# EAGLE design Summing (EAGLE 6.5.0)
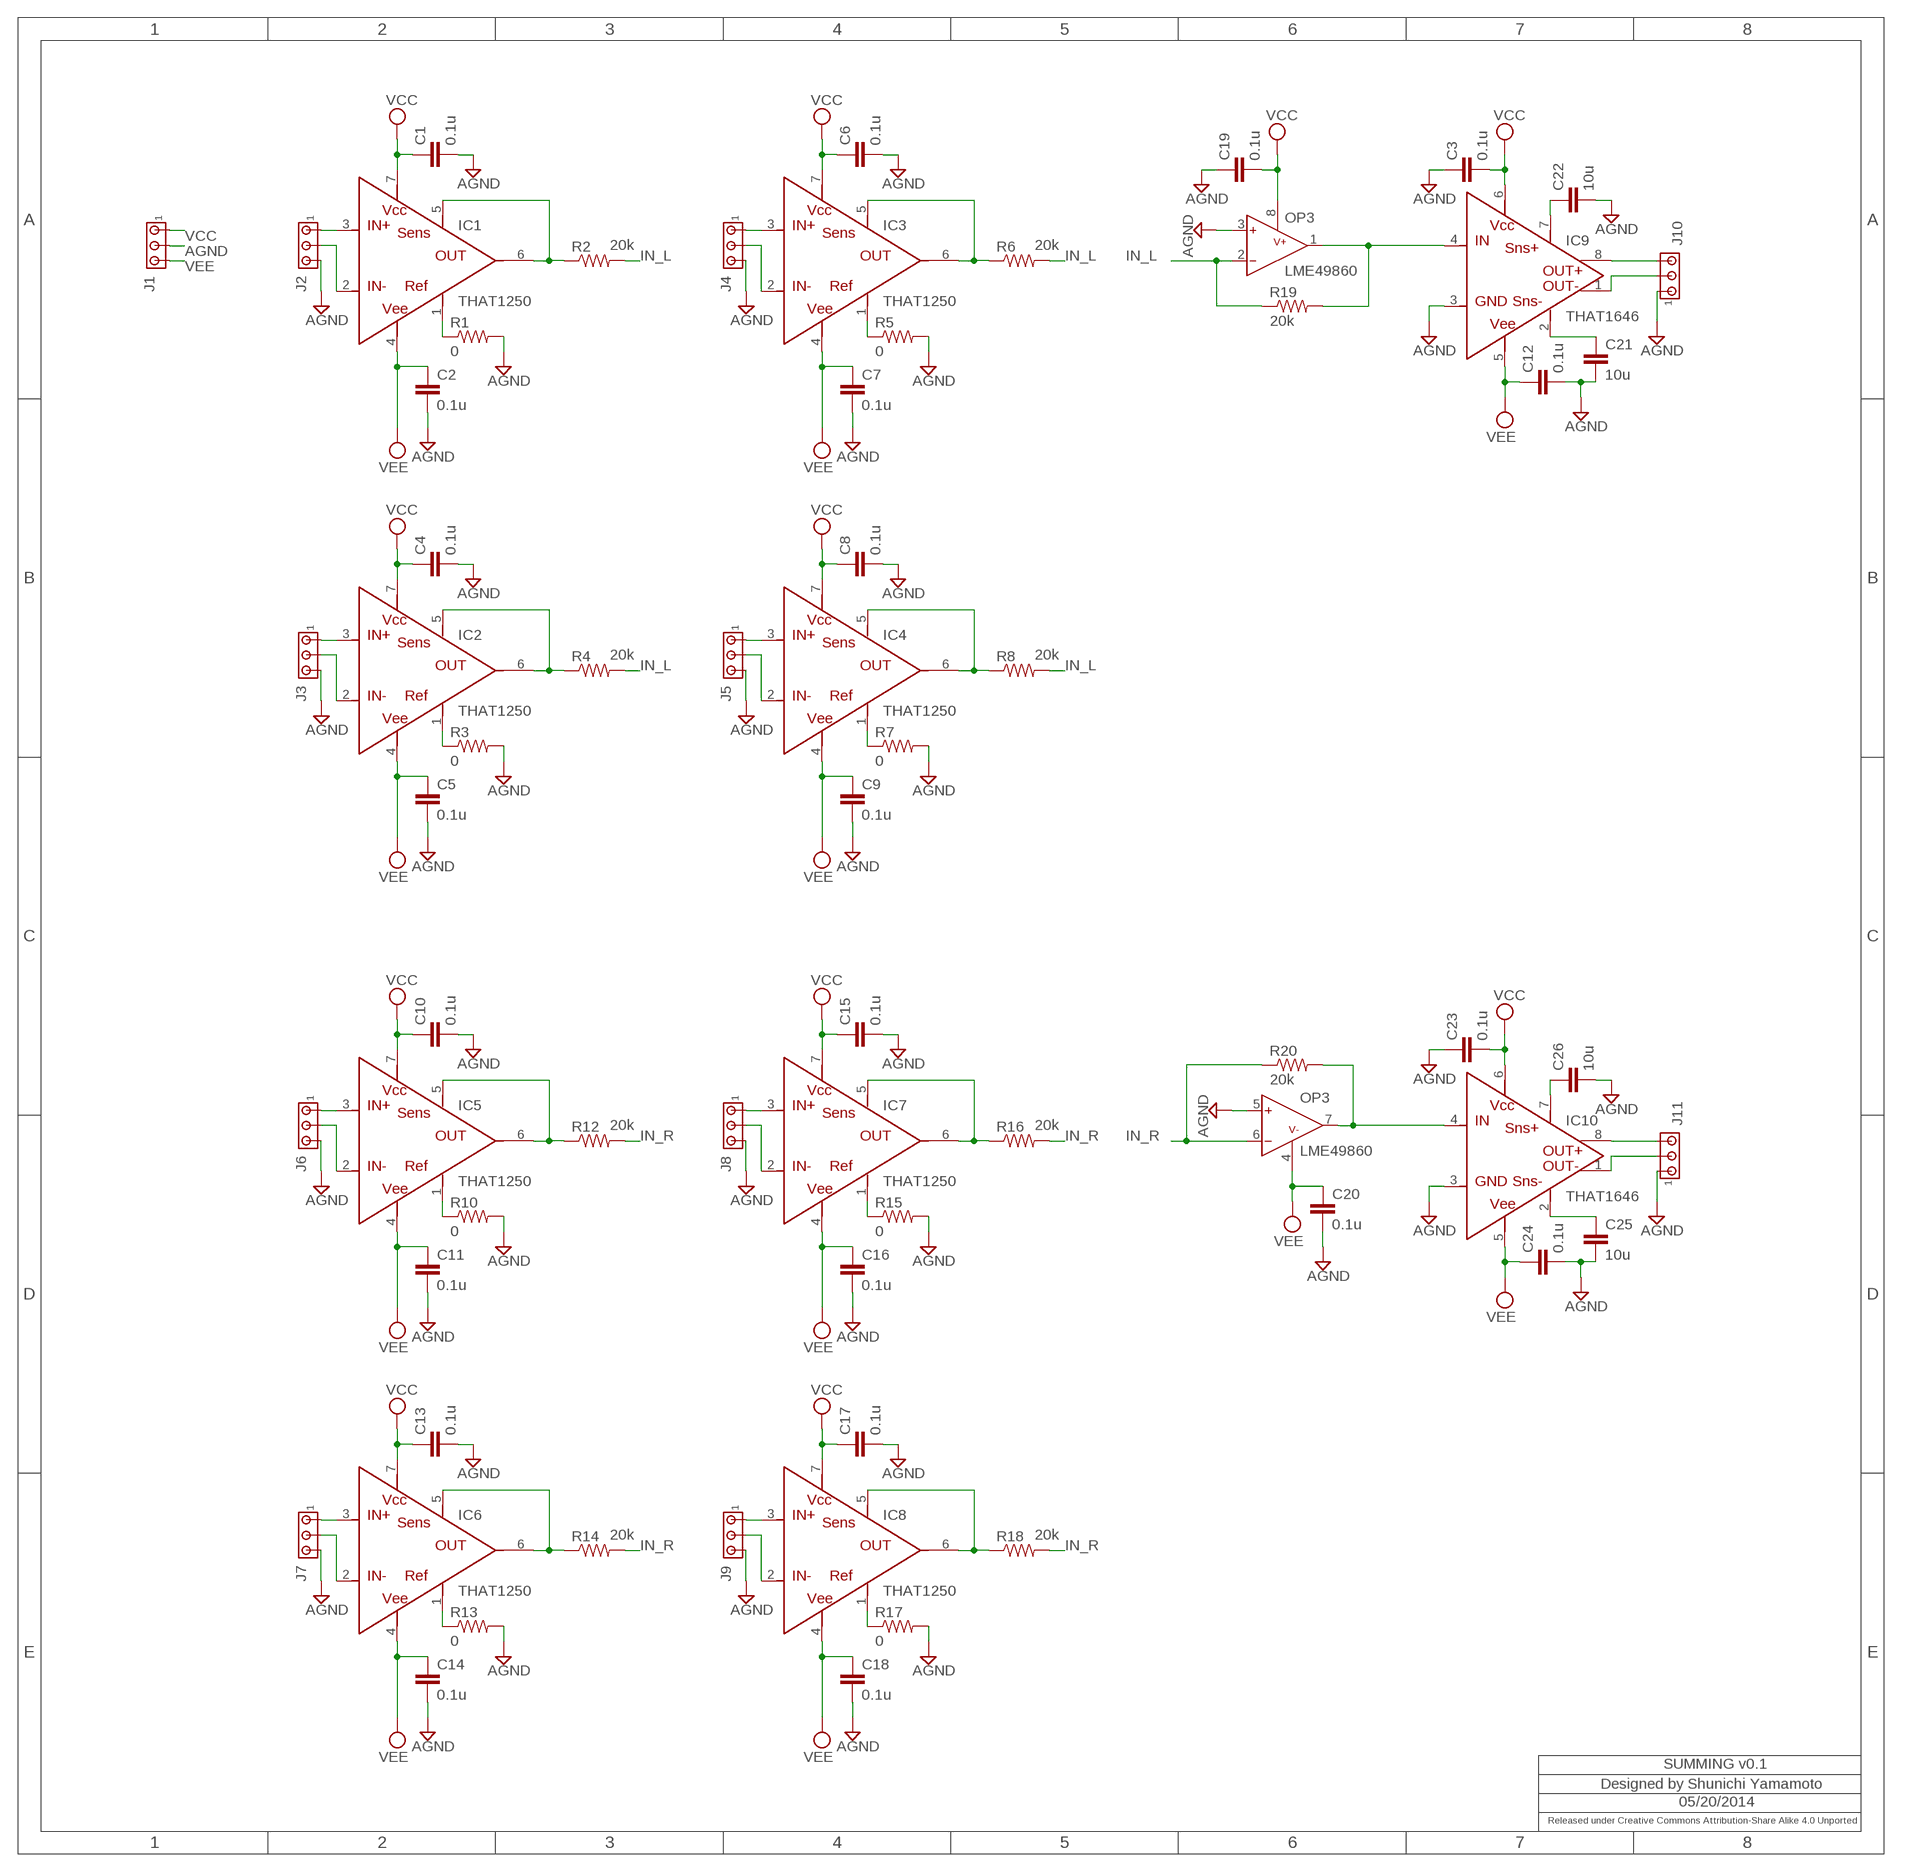
[diagram p0: schematic, sheet 1]

## Parts
C1  0.1u  C-EUC2012  [C2012]
C2  0.1u  C-EUC2012  [C2012]
C3  0.1u  C-EUC2012  [C2012]
C4  0.1u  C-EUC2012  [C2012]
C5  0.1u  C-EUC2012  [C2012]
C6  0.1u  C-EUC2012  [C2012]
C7  0.1u  C-EUC2012  [C2012]
C8  0.1u  C-EUC2012  [C2012]
C9  0.1u  C-EUC2012  [C2012]
C10  0.1u  C-EUC2012  [C2012]
C11  0.1u  C-EUC2012  [C2012]
C12  0.1u  C-EUC2012  [C2012]
C13  0.1u  C-EUC2012  [C2012]
C14  0.1u  C-EUC2012  [C2012]
C15  0.1u  C-EUC2012  [C2012]
C16  0.1u  C-EUC2012  [C2012]
C17  0.1u  C-EUC2012  [C2012]
C18  0.1u  C-EUC2012  [C2012]
C19  0.1u  C-EUC2012  [C2012]
C20  0.1u  C-EUC2012  [C2012]
C21  10u  C-EUC2012  [C2012]
C22  10u  C-EUC2012  [C2012]
C23  0.1u  C-EUC2012  [C2012]
C24  0.1u  C-EUC2012  [C2012]
C25  10u  C-EUC2012  [C2012]
C26  10u  C-EUC2012  [C2012]
IC1  THAT1250  [SOIC8@1]
IC2  THAT1250  [SOIC8@1]
IC3  THAT1250  [SOIC8@1]
IC4  THAT1250  [SOIC8@1]
IC5  THAT1250  [SOIC8@1]
IC6  THAT1250  [SOIC8@1]
IC7  THAT1250  [SOIC8@1]
IC8  THAT1250  [SOIC8@1]
IC9  THAT1646  [SOIC8]
IC10  THAT1646  [SOIC8]
J1  MTA03-156  [1X3MTA]
J2  MTA03-100  [10X03MTA]
J3  MTA03-100  [10X03MTA]
J4  MTA03-100  [10X03MTA]
J5  MTA03-100  [10X03MTA]
J6  MTA03-100  [10X03MTA]
J7  MTA03-100  [10X03MTA]
J8  MTA03-100  [10X03MTA]
J9  MTA03-100  [10X03MTA]
J10  MTA03-100  [10X03MTA]
J11  MTA03-100  [10X03MTA]
OP3  LME49860  [SOIC8@2]
R1  0  RESISTOR0805-RES  [0805]
R2  20k  RESISTOR0805-RES  [0805]
R3  0  RESISTOR0805-RES  [0805]
R4  20k  RESISTOR0805-RES  [0805]
R5  0  RESISTOR0805-RES  [0805]
R6  20k  RESISTOR0805-RES  [0805]
R7  0  RESISTOR0805-RES  [0805]
R8  20k  RESISTOR0805-RES  [0805]
R10  0  RESISTOR0805-RES  [0805]
R12  20k  RESISTOR0805-RES  [0805]
R13  0  RESISTOR0805-RES  [0805]
R14  20k  RESISTOR0805-RES  [0805]
R15  0  RESISTOR0805-RES  [0805]
R16  20k  RESISTOR0805-RES  [0805]
R17  0  RESISTOR0805-RES  [0805]
R18  20k  RESISTOR0805-RES  [0805]
R19  20k  RESISTOR0805-RES  [0805]
R20  20k  RESISTOR0805-RES  [0805]

## Nets
AGND: C1.2 C2.2 C3.1 C4.2 C5.2 C6.2 C7.2 C8.2 C9.2 C10.2 C11.2 C12.2 C13.2 C14.2 C15.2 C16.2 C17.2 C18.2 C19.1 C20.2 C21.2 C22.2 C23.1 C24.2 C25.2 C26.2 IC9.3(GND) IC10.3(GND) J1.2 J2.3 J3.3 J4.3 J5.3 J6.3 J7.3 J8.3 J9.3 J10.1 J11.1 OP3.3(INA+) OP3.5(INB+) R1.2 R3.2 R5.2 R7.2 R10.2 R13.2 R15.2 R17.2
IN_L: OP3.2(INA-) R2.2 R4.2 R6.2 R8.2 R19.1
IN_R: OP3.6(INB-) R12.2 R14.2 R16.2 R18.2 R20.1
MGAIN_L2: IC9.4(IN) OP3.1(OUTA) R19.2
MGAIN_R: IC10.4(IN) OP3.7(OUTB) R20.2
N$1: IC1.1(REF) R1.1
N$2: IC2.1(REF) R3.1
N$3: IC1.3(IN+) J2.1
N$4: IC1.2(IN-) J2.2
N$5: IC2.3(IN+) J3.1
N$6: IC2.2(IN-) J3.2
N$7: IC3.1(REF) R5.1
N$8: IC3.3(IN+) J4.1
N$9: IC3.2(IN-) J4.2
N$10: IC4.1(REF) R7.1
N$11: IC4.3(IN+) J5.1
N$12: IC4.2(IN-) J5.2
N$13: IC5.1(REF) R10.1
N$14: IC5.3(IN+) J6.1
N$15: IC5.2(IN-) J6.2
N$16: IC6.1(REF) R13.1
N$17: IC6.3(IN+) J7.1
N$18: IC6.2(IN-) J7.2
N$19: IC7.1(REF) R15.1
N$20: IC7.3(IN+) J8.1
N$21: IC7.2(IN-) J8.2
N$22: IC8.1(REF) R17.1
N$23: IC8.3(IN+) J9.1
N$24: IC8.2(IN-) J9.2
N$25: C22.1 IC9.7(SNS+)
N$26: IC9.8(OUT+) J10.3
N$27: IC9.1(OUT-) J10.2
N$28: C26.1 IC10.7(SNS+)
N$29: C25.1 IC10.2(SNS-)
N$30: IC10.8(OUT+) J11.3
N$31: IC10.1(OUT-) J11.2
N$34: C21.1 IC9.2(SNS-)
PIN_L: IC1.5(SENS) IC1.6(OUT) R2.1
PIN_L1: IC2.5(SENS) IC2.6(OUT) R4.1
PIN_L2: IC3.5(SENS) IC3.6(OUT) R6.1
PIN_L3: IC4.5(SENS) IC4.6(OUT) R8.1
PIN_L4: IC5.5(SENS) IC5.6(OUT) R12.1
PIN_L5: IC6.5(SENS) IC6.6(OUT) R14.1
PIN_L6: IC7.5(SENS) IC7.6(OUT) R16.1
PIN_L7: IC8.5(SENS) IC8.6(OUT) R18.1
VCC: C1.1 C3.2 C4.1 C6.1 C8.1 C10.1 C13.1 C15.1 C17.1 C19.2 C23.2 IC1.7(VCC) IC2.7(VCC) IC3.7(VCC) IC4.7(VCC) IC5.7(VCC) IC6.7(VCC) IC7.7(VCC) IC8.7(VCC) IC9.6(VCC) IC10.6(VCC) J1.1 OP3.8(V+)
VEE: C2.1 C5.1 C7.1 C9.1 C11.1 C12.1 C14.1 C16.1 C18.1 C20.1 C24.1 IC1.4(VEE) IC2.4(VEE) IC3.4(VEE) IC4.4(VEE) IC5.4(VEE) IC6.4(VEE) IC7.4(VEE) IC8.4(VEE) IC9.5(VEE) IC10.5(VEE) J1.3 OP3.4(V-)

## Notes on the sheet
- SUMMING v0.1
- Designed by Shunichi Yamamoto
- 05/20/2014
- Released under Creative Commons Attribution-Share Alike 4.0 Unported

## Library data of the parts
C1-C26 = rcl:C-EU: CAPACITOR, European symbol
IC1-IC8 = thatcorp:THAT1250
IC9 IC10 = thatcorp:THAT1646
J1 = con-amp:MTA03-156: AMP connector
J2-J11 = con-amp:MTA03-100: AMP connector
OP3 = thatcorp:LME49860
R1-R8 R10 R12-R20 = SparkFun:RESISTOR: Resistor Basic schematic elements and footprints for 0603, 1206, and PTH resistors.

## Board
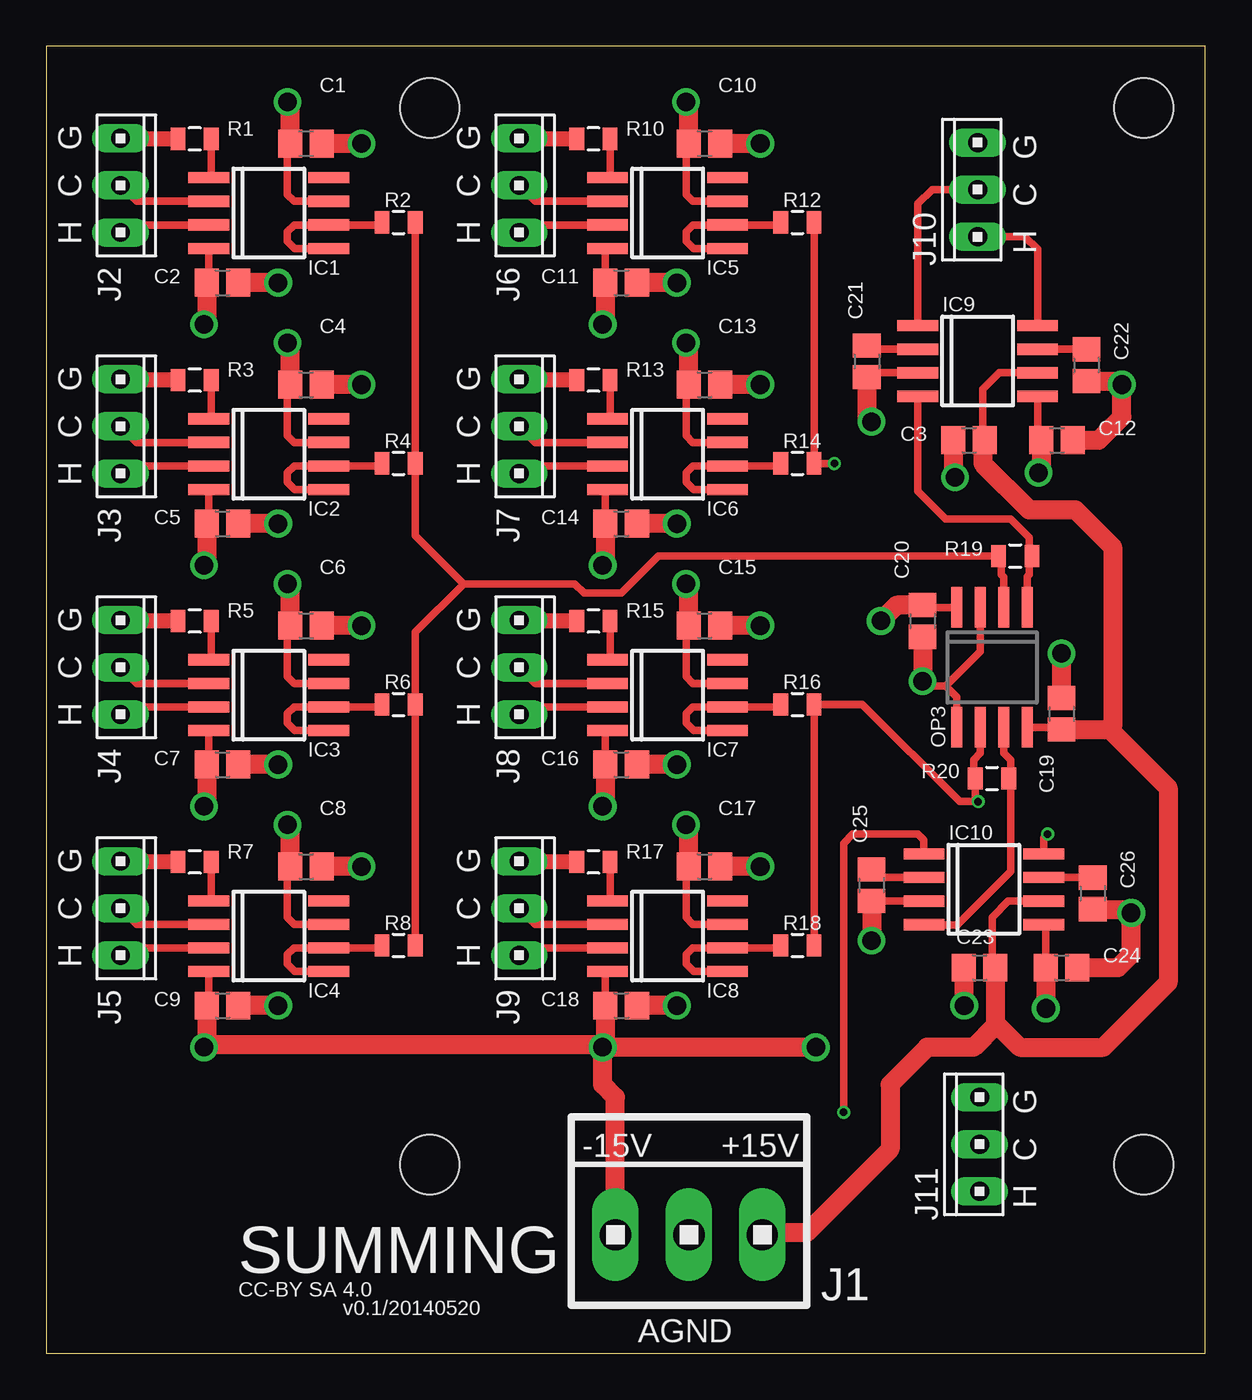
[diagram p1: board, top side]
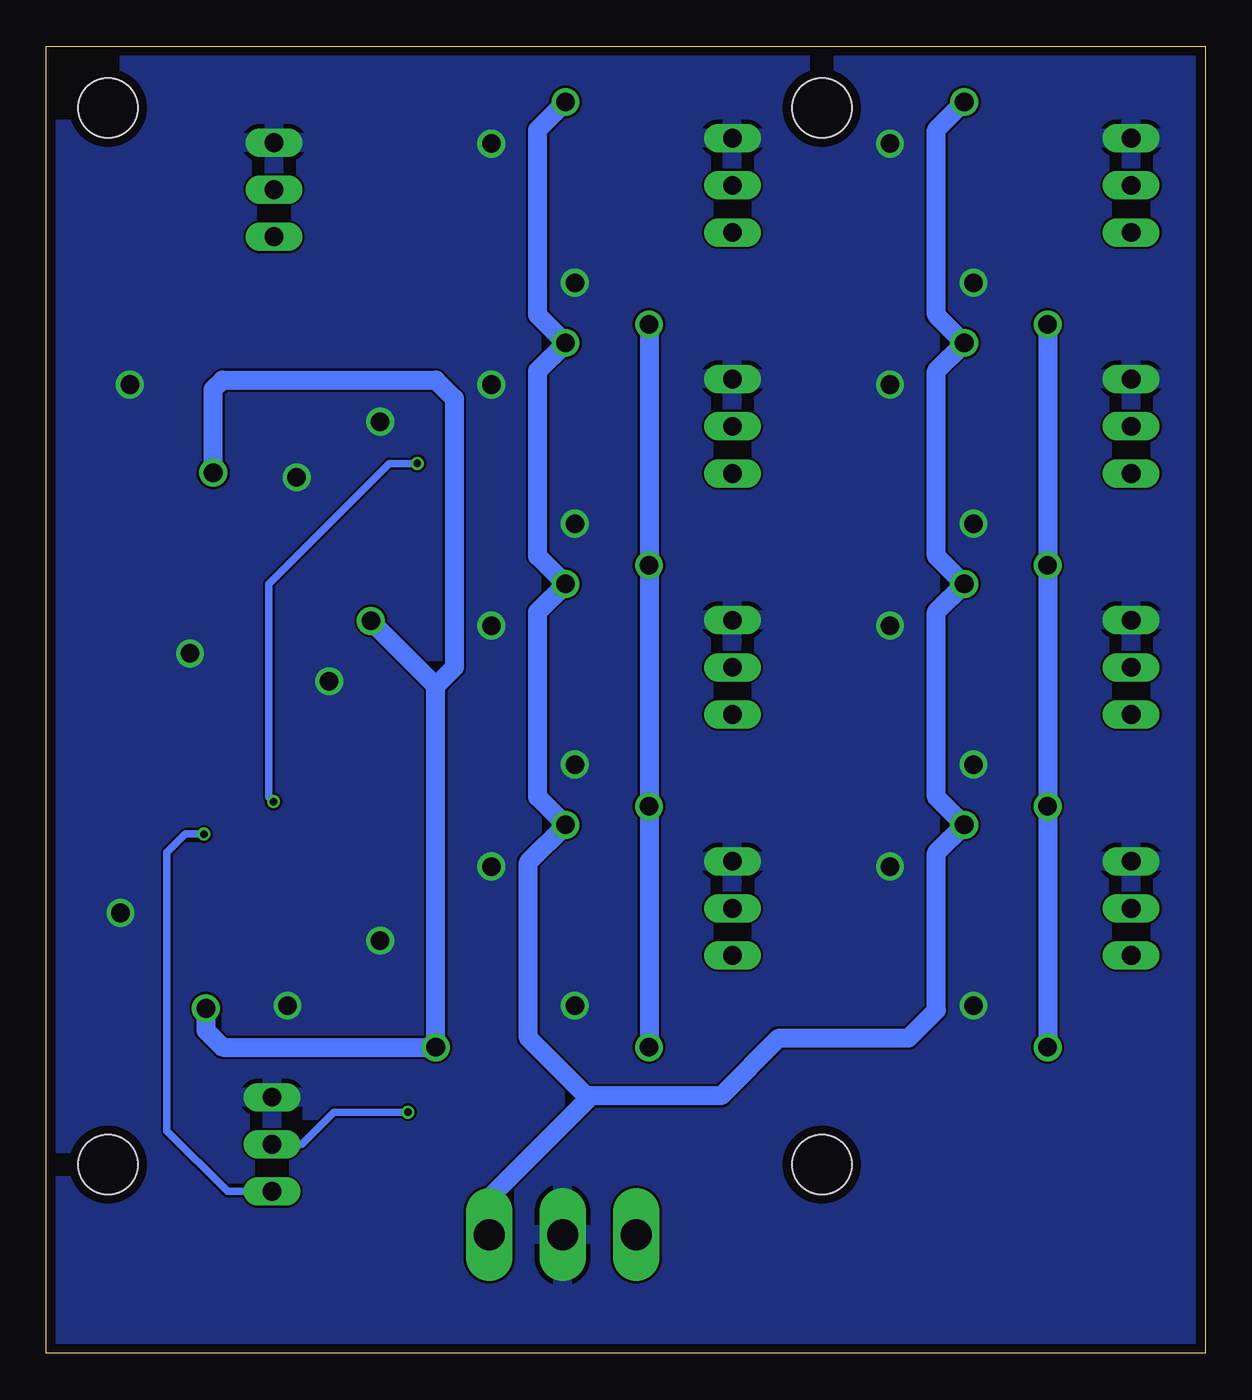
[diagram p2: board, bottom side, seen from below]

Size 62.5 x 70.5 mm. Coordinates in mm from the lower left corner, seen from the top.
Outline: 0,0 62.5,0 62.5,70.5 0,70.5 0,0
Copper layers (1+2*3+16): Top 0.018mm / dielectric 0.25mm / Route2 0.035mm / dielectric 1mm / Route3 0.035mm / dielectric 0.2mm / Bottom 0.018mm
Design rules "pban_5mil-l4-a": minimum track width 5mil, minimum drill 0.3mm, track to track 5mil, track to pad 0.229mm, pad to pad 5mil, via to via 5mil, smd to smd 5mil, copper to edge 0.5mm, drill to drill 0.5mm, minimum pad ring 0.15mm, minimum via ring 0.15mm, stop-mask expansion 4mil, vias tented up to drill 0.35mm, thermal gap 10mil
Holes 3.2 mm at 20.68,10.18 20.68,67.17 59.17,10.18 59.17,67.17

### Footprints (pad centres in the part's own frame; a part is rotated, then mirrored left to right if it is on the bottom)
C2012 = smd 1.3 x 1.5: 1 -0.85,0; 2 0.85,0
SOIC8@1 = smd 0.6 x 2.2: 1 -1.905,-3.235; 2 -0.635,-3.235; 3 0.635,-3.235; 4 1.905,-3.235; 5 1.905,3.235; 6 0.635,3.235; 7 -0.635,3.235; 8 -1.905,3.235
SOIC8 = smd 0.6 x 2.2: 1 -1.905,-3.235; 2 -0.635,-3.235; 3 0.635,-3.235; 4 1.905,-3.235; 5 1.905,3.235; 6 0.635,3.235; 7 -0.635,3.235; 8 -1.905,3.235
1X3MTA = drill 1.676 long: 1 3.937,0; 2 -0.025,0; 3 -3.988,0
10X03MTA = drill 1.016 long: 1 2.54,0; 2 0,0; 3 -2.54,0
SOIC8@2 = smd 0.6 x 2.2: 1 -1.905,-3.235; 2 -0.635,-3.235; 3 0.635,-3.235; 4 1.905,-3.235; 5 1.905,3.235; 6 0.635,3.235; 7 -0.635,3.235; 8 -1.905,3.235
0805 = smd 0.8 x 1.2: 1 -0.9,0; 2 0.9,0

### Placement (x,y rotation side)
C1  14,65.25 0 top
C2  9.5,57.75 0 top
C3  49.75,49.25 0 top
C4  14,52.25 0 top
C5  9.5,44.75 0 top
C6  14,39.25 0 top
C7  9.5,31.75 0 top
C8  14,26.25 0 top
C9  9.5,18.75 0 top
C10  35.5,65.25 0 top
C11  31,57.75 0 top
C12  54.5,49.25 0 top
C13  35.5,52.25 0 top
C14  31,44.75 0 top
C15  35.5,39.25 0 top
C16  31,31.75 0 top
C17  35.5,26.25 0 top
C18  31,18.75 0 top
C19  54.75,34.5 270 top
C20  47.25,39.5 270 top
C21  44.25,53.5 270 top
C22  56.09,53.3 270 top
C23  50.33,20.8 0 top
C24  54.75,20.8 0 top
C25  44.5,25.25 270 top
C26  56.43,24.8 270 top
IC1  12,61.5 270 top
IC2  12,48.5 270 top
IC3  12,35.5 270 top
IC4  12,22.5 270 top
IC5  33.5,61.5 270 top
IC6  33.5,48.5 270 top
IC7  33.5,35.5 270 top
IC8  33.5,22.5 270 top
IC9  50.22,53.52 270 top
IC10  50.56,25.02 270 top
J1  34.68,6.39 0 top
J2  4,63 270 top
J3  4,50 270 top
J4  4,37 270 top
J5  4,24 270 top
J6  25.5,63 270 top
J7  25.5,50 270 top
J8  25.5,37 270 top
J9  25.5,24 270 top
J10  50.22,62.77 90 top
J11  50.33,11.27 90 top
OP3  51,37 180 top
R1  8,65.5 180 top
R2  19,61 0 top
R3  8,52.5 180 top
R4  19,48 0 top
R5  8,39.5 180 top
R6  19,35 0 top
R7  8,26.5 180 top
R8  19,22 0 top
R10  29.5,65.5 180 top
R12  40.5,61 0 top
R13  29.5,52.5 180 top
R14  40.5,48 0 top
R15  29.5,39.5 180 top
R16  40.5,35 0 top
R17  29.5,26.5 180 top
R18  40.5,22 0 top
R19  52.25,43 0 top
R20  51,31 0 top

### Tracks (layer width: path | path; a pad name or v marks a point on that pad's centre or on a via)
AGND  (via drill 1)
  Top 0.406: OP3.5 49.09,35.41 48.5,36 | 48.5,36 47.5,36 v47.25,36.25 | OP3.3 50.37,37.87 48.5,36 | C25.2 47.31,24.4 IC10.3 | IC9.3 44.48,52.88 C21.2
  Top 0.813: R1.2 4.04,65.5 J2.3 | R3.2 4.04,52.5 J3.3 | R5.2 4.04,39.5 J4.3 | R7.2 4.04,26.5 J5.3 | R10.2 25.54,65.5 J6.3 | R13.2 25.54,52.5 J7.3 | R15.2 25.54,39.5 J8.3 | R17.2 25.54,26.5 J9.3
  Top 1.016: v12.5,57.75 C2.2 | v34,57.75 C11.2 | v12.5,44.75 C5.2 | v34,44.75 C14.2 | v12.5,31.75 C7.2 | v34,31.75 C16.2 | v12.5,18.75 C9.2 | v34,18.75 C18.2 | v17,26.25 C8.2 | v38.5,26.25 C17.2 | v17,39.25 C6.2 | v38.5,39.25 C15.2 | v17,52.25 C4.2 | v38.5,52.25 C13.2 | v17,65.25 C1.2 | v38.5,65.25 C10.2 | C20.2 v47.25,36.25 | C19.1 v54.75,37.75 | C21.2 44.25,50.5 v44.5,50.25 | C3.1 48.9,47.35 v49,47.25 | C25.2 v44.5,22.25 | C23.1 49.48,18.77 v49.5,18.75 | C26.2 58.3,23.95 v58.5,23.75 58.5,21.5 57.8,20.8 C24.2 | C22.2 57.8,52.45 v58,52.25 58,50.5 56.75,49.25 C12.2
  pour Bottom: 0,0 62.5,0 62.5,70.5 0,70.5
IN_L
  Top 0.406: OP3.2 51.63,41.87 51.5,42 51.5,43.1 R19.1 33,43 31,41 29,41 28.5,41.5 22.5,41.5 | R2.2 R4.2 19.9,44.1 22.5,41.5 | R8.2 R6.2 19.9,38.9 22.5,41.5
IN_R  (via drill 0.4)
  Top 0.406: OP3.6 50.37,32.37 50,32 50,30.85 R20.1 50.1,29.9 v50.25,29.75 49.25,29.75 44,35 R16.2 R18.2 | R12.2 R14.2 v42.5,48
  Bottom 0.406: v50.25,29.75 50.5,30 50.5,41.5 44,48 v42.5,48
MGAIN_L2
  Top 0.406: OP3.1 52.91,41.91 53,42 53,43.1 R19.2 53,43.15 53,44 52,45 48.5,45 46.98,46.52 IC9.4
MGAIN_R
  Top 0.406: OP3.7 51.63,32.37 52,32 52,30.85 R20.2 52,30.9 52,26 49.12,23.11 IC10.4
N$1
  Top 0.406: R1.1 8.9,63.54 IC1.1
N$2
  Top 0.406: R3.1 8.9,50.54 IC2.1
N$3
  Top 0.406: IC1.3 4.4,60.87 J2.1
N$4
  Top 0.406: IC1.2 4.87,62.13 J2.2
N$5
  Top 0.406: IC2.3 4.4,47.87 J3.1
N$6
  Top 0.406: IC2.2 4.87,49.13 J3.2
N$7
  Top 0.406: R5.1 8.9,37.54 IC3.1
N$8
  Top 0.406: IC3.3 4.4,34.87 J4.1
N$9
  Top 0.406: IC3.2 4.87,36.13 J4.2
N$10
  Top 0.406: R7.1 8.9,24.54 IC4.1
N$11
  Top 0.406: IC4.3 4.4,21.86 J5.1
N$12
  Top 0.406: IC4.2 4.87,23.14 J5.2
N$13
  Top 0.406: R10.1 30.4,63.54 IC5.1
N$14
  Top 0.406: IC5.3 25.91,60.87 J6.1
N$15
  Top 0.406: IC5.2 26.36,62.13 J6.2
N$16
  Top 0.406: R13.1 30.4,50.54 IC6.1
N$17
  Top 0.406: IC6.3 25.91,47.87 J7.1
N$18
  Top 0.406: IC6.2 26.36,49.13 J7.2
N$19
  Top 0.406: R15.1 30.4,37.54 IC7.1
N$20
  Top 0.406: IC7.3 25.91,34.87 J8.1
N$21
  Top 0.406: IC7.2 26.36,36.13 J8.2
N$22
  Top 0.406: R17.1 30.4,24.54 IC8.1
N$23
  Top 0.406: IC8.3 25.91,21.86 J9.1
N$24
  Top 0.406: IC8.2 26.36,23.14 J9.2
N$25
  Top 0.406: IC9.7 C22.1
N$26
  Top 0.406: IC9.8 53.45,59.55 52.77,60.23 J10.3
N$27
  Top 0.406: J10.2 47.77,62.77 47,62 47,55.44 IC9.1
N$28
  Top 0.406: IC10.7 C26.1
N$29
  Top 0.406: IC10.2 44.95,25.66 C25.1
N$30  (via drill 0.4)
  Top 0.406: IC10.8 53.8,27.8 v54,28
  Bottom 0.406: v54,28 55,28 56,27 56,12 52.73,8.73 J11.3
N$31  (via drill 0.4)
  Top 0.406: IC10.1 47.33,27.68 47,28 43.5,28 43,27.5 v43,13
  Bottom 0.406: v43,13 47,13 48.73,11.27 J11.2
N$34
  Top 0.406: IC9.2 44.45,54.16 C21.1
PIN_L
  Top 0.406: IC1.5 13.4,59.59 13,60 13,60.5 13.37,60.87 IC1.6 17.96,60.87 R2.1
PIN_L1
  Top 0.406: IC2.5 13.4,46.59 13,47 13,47.5 13.37,47.87 IC2.6 17.96,47.87 R4.1
PIN_L2
  Top 0.406: IC3.5 13.4,33.59 13,34 13,34.5 13.37,34.87 IC3.6 17.96,34.87 R6.1
PIN_L3
  Top 0.406: IC4.5 13.4,20.59 13,21 13,21.5 13.37,21.86 IC4.6 17.96,21.86 R8.1
PIN_L4
  Top 0.406: IC5.5 34.91,59.59 34.5,60 34.5,60.5 34.87,60.87 IC5.6 39.47,60.87 R12.1
PIN_L5
  Top 0.406: IC6.5 34.91,46.59 34.5,47 34.5,47.5 34.87,47.87 IC6.6 39.47,47.87 R14.1
PIN_L6
  Top 0.406: IC7.5 34.91,33.59 34.5,34 34.5,34.5 34.87,34.87 IC7.6 39.47,34.87 R16.1
PIN_L7
  Top 0.406: IC8.5 34.91,20.59 34.5,21 34.5,21.5 34.87,21.86 IC8.6 39.47,21.86 R18.1
VCC  (via drill 1)
  Top 0.406: IC2.7 13.37,49.13 13,49.5 13,52.1 C4.1 | IC3.7 13.37,36.13 13,36.5 13,39.1 C6.1 | IC4.7 13.37,23.14 13,23.5 13,26.1 C8.1 | IC6.7 34.87,49.13 34.5,49.5 34.5,52.1 C13.1 | IC7.7 34.87,36.13 34.5,36.5 34.5,39.1 C15.1 | IC8.7 34.87,23.14 34.5,23.5 34.5,26.1 C17.1 | IC5.7 34.87,62.13 34.5,62.5 34.5,65.1 C10.1 | OP3.8 54.63,33.77 C19.2 | IC9.6 51.38,52.88 50.5,52 50.5,49.35 C3.2 | IC10.6 51.88,24.39 51,23.5 51,20.98 C23.2 | IC1.7 13.37,62.13 13,62.5 13,65.1 C1.1
  Top 1.016: C1.1 13.15,67.35 v13,67.5 | C10.1 34.65,67.35 v34.5,67.5 | C13.1 34.65,54.35 v34.5,54.5 | C15.1 34.65,41.35 v34.5,41.5 | C17.1 34.65,28.35 v34.5,28.5 | C8.1 13.15,28.35 v13,28.5 | C6.1 13.15,41.35 v13,41.5 | C4.1 13.15,54.35 v13,54.5 | C19.2 57.35,33.65 | 57.35,33.65 57.5,33.8 57.5,43.5 55.5,45.5 53,45.5 50.5,48 50.5,49.35 | 57.35,33.65 60.5,30.5 60.5,20 57,16.5 52.5,16.5 51.32,17.68 51.18,17.68 | C23.2 51.18,17.68 | 51.18,17.68 50,16.5 47.5,16.5 45.5,14.5 45.5,11 41,6.5 38.73,6.5 J1.1
  Bottom 1.016: v13,67.5 14.5,66 14.5,56 v13,54.5 14.5,53 14.5,43 v13,41.5 14.5,40 14.5,30 v13,28.5 14.5,27 14.5,18.5 16,17 23,17 26.12,13.88 33.38,13.88 | v34.5,67.5 36,66 36,56 v34.5,54.5 36,53 36,43 v34.5,41.5 36,40 36,30 v34.5,28.5 36.5,26.5 36.5,17 33.38,13.88 | 33.38,13.88 33.38,13.62 38.5,8.5 38.5,6.51 J1.1
VEE  (via drill 1)
  Top 0.406: IC4.4 8.77,18.86 C9.1 | IC3.4 8.77,31.86 C7.1 | IC2.4 8.77,44.87 C5.1 | IC1.4 8.77,57.87 C2.1 | C18.1 30.15,20.48 IC8.4 | C16.1 30.15,33.48 IC7.4 | C14.1 30.15,46.48 IC6.4 | C11.1 30.15,59.48 IC5.4 | OP3.4 47.37,40.23 C20.1 | IC9.5 53.45,49.45 C12.1 | C24.1 53.9,23.01 IC10.5
  Top 1.016: C2.1 8.65,55.65 v8.5,55.5 | C5.1 8.65,42.65 v8.5,42.5 | C7.1 8.65,29.65 v8.5,29.5 | C9.1 8.65,16.65 | 8.65,16.65 v8.5,16.5 | C11.1 30.15,55.65 v30,55.5 | C14.1 30.15,42.65 v30,42.5 | C16.1 30.15,29.65 v30,29.5 | C18.1 30.15,16.65 v30,16.5 | 8.65,16.65 30.35,16.65 30.5,16.5 | C20.1 45.85,40.35 v45,39.5 | v41.5,16.5 30.5,16.5 | 30.5,16.5 v30,16.5 | C12.1 53.65,47.65 v53.5,47.5 | C24.1 v53.9,18.6 | J1.3 30.69,13.81 30,14.5 v30,16.5
  Bottom 1.016: v8.5,16.5 v8.5,29.5 v8.5,42.5 v8.5,55.5 | v30,55.5 v30,42.5 v30,29.5 v30,16.5 | 41.5,36 v41.5,16.5 53,16.5 53.9,17.4 v53.9,18.6 | 41.5,36 v45,39.5 | 41.5,36 40.5,37 40.5,51.5 41.5,52.5 53,52.5 53.5,52 v53.5,47.5

### Text on the board
tNames: G | G | G | C | C | C | H | H | H | G | G | C | C | H | H | G | G | C | C | H | H | G | G | C | C | H | H | G | -15V | +15V | C | H | SUMMING | CC-BY SA 4.0 | v0.1/20140520 | AGND